# Altium schematic sheet pogoprog.SchDoc
size A
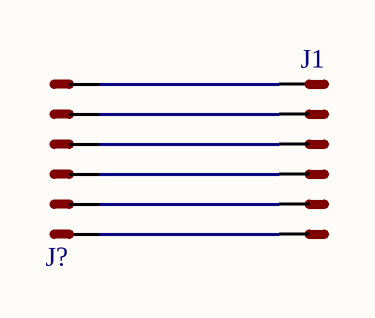
[diagram p0: pogoprog.SchDoc]

## Parts
J1  (no value)  [HEADER_2X3PINS_MALE]
J?  J_POGO_PROG  [POGO_PROG]  (value not drawn)

## Nets
NetJ1_1: J1.1(S) J?.6(S)
NetJ1_2: J1.2(S) J?.5(S)
NetJ1_3: J1.3(S) J?.4(S)
NetJ1_4: J1.4(S) J?.3(S)
NetJ1_5: J1.5(S) J?.2(S)
NetJ1_6: J1.6(S) J?.1(S)

## Library data of the parts
J1 = J_HEADER_2X3PINS_MALE